# EAGLE schematic ESP32-defkit (EAGLE 9.4.2)
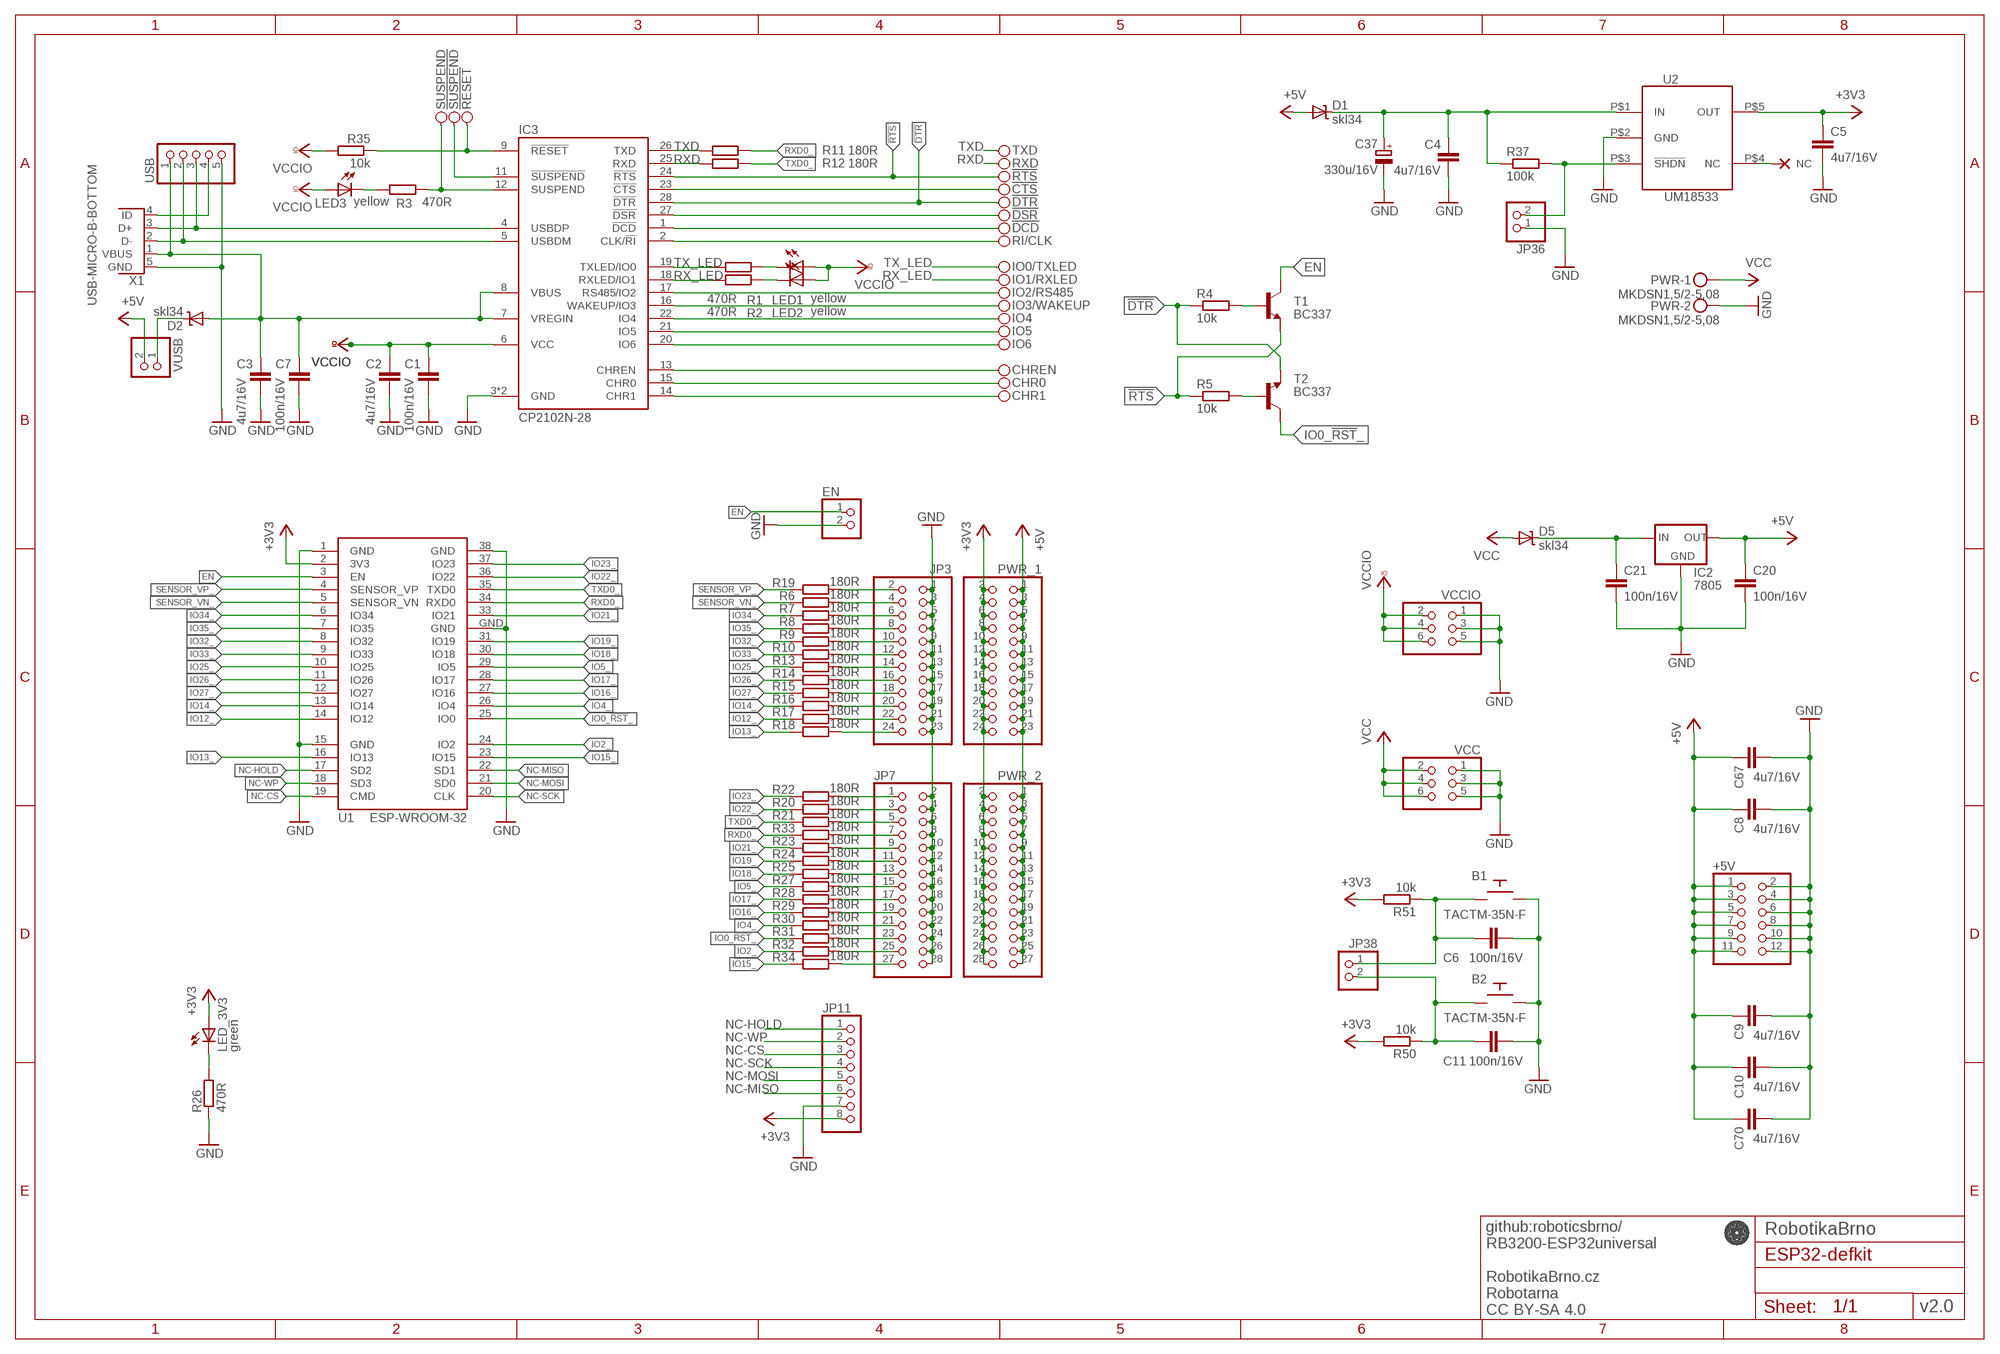
[diagram p0: schematic, sheet 1]

## Parts
!CTS  PINH1X01  [1X01]
!DCD  PINH1X01  [1X01]
!DSR  PINH1X01  [1X01]
!DTR  PINH1X01  [1X01]
!RESET  PINH1X01  [1X01]
!RTS  PINH1X01  [1X01]
!SUSPEND  PINH1X01  [1X01]
+5V  PINHD-2X6  [2X06]
B1  TACTM-35N-F  [TACTM-35N-F]
B2  TACTM-35N-F  [TACTM-35N-F]
C1  100n/16V  C-EUC0402  [C0402]
C2  4u7/16V  C-EUC0603  [C0603]
C3  4u7/16V  C-EUC0603  [C0603]
C4  4u7/16V  C-EUC0603  [C0603]
C5  4u7/16V  C-EUC0603  [C0603]
C6  100n/16V  C-EUC0402  [C0402]
C7  100n/16V  C-EUC0402  [C0402]
C8  4u7/16V  C-EUC0805  [C0805]
C9  4u7/16V  C-EUC0805  [C0805]
C10  4u7/16V  C-EUC0805  [C0805]
C11  100n/16V  C-EUC0402  [C0402]
C20  100n/16V  C-EUC0402  [C0402]
C21  100n/16V  C-EUC0402  [C0402]
C37  330u/16V  CPOL-EUE5-10.5  [E5-10,5]
C67  4u7/16V  C-EUC0805  [C0805]
C70  4u7/16V  C-EUC0805  [C0805]
CHR0  PINH1X01  [1X01]
CHR1  PINH1X01  [1X01]
CHREN  PINH1X01  [1X01]
D1  skl34  SHOTTKY-SOD123  [SOD123]
D2  skl34  SHOTTKY-SOD123  [SOD123]
D5  skl34  SHOTTKY-SOD123  [SOD123]
EN  PINHD-1X2  [1X02]
IC2  7805  78XXS  [78XXS]
IC3  CP2102N-28  [QFN28-PAD]
IO0/TXLED  PINH1X01  [1X01]
IO1/RXLED  PINH1X01  [1X01]
IO2/RS485  PINH1X01  [1X01]
IO3/WAKEUP  PINH1X01  [1X01]
IO4  PINH1X01  [1X01]
IO5  PINH1X01  [1X01]
IO6  PINH1X01  [1X01]
JP3  PINHD-2X12  [2X12]
JP7  PINHD-2X14  [2X14]
JP11  PINHD-1X8  [1X08]
JP36  PINHD-1X2  [1X02]
JP38  PINHD-1X2  [1X02]
LED1  yellow  LEDCHIP-LED0603  [CHIP-LED0603]
LED2  yellow  LEDCHIP-LED0603  [CHIP-LED0603]
LED3  yellow  LEDCHIP-LED0603  [CHIP-LED0603]
LED_3V3  green  LEDCHIPLED_0603  [CHIPLED_0603]
NC3  NC  (no package)
PWR  MKDSN1,5/2-5,08  [MKDSN1,5/2-5,08]
PWR_1  PINHD-2X12  [2X12]
PWR_2  PINHD-2X14  [2X14]
R1  470R  R-EU_R0603  [R0603]
R2  470R  R-EU_R0603  [R0603]
R3  470R  R-EU_R0603  [R0603]
R4  10k  R-EU_R0603  [R0603]
R5  10k  R-EU_R0603  [R0603]
R6  180R  R-EU_R0603  [R0603]
R7  180R  R-EU_R0603  [R0603]
R8  180R  R-EU_R0603  [R0603]
R9  180R  R-EU_R0603  [R0603]
R10  180R  R-EU_R0603  [R0603]
R11  180R  R-EU_R0603  [R0603]
R12  180R  R-EU_R0603  [R0603]
R13  180R  R-EU_R0603  [R0603]
R14  180R  R-EU_R0603  [R0603]
R15  180R  R-EU_R0603  [R0603]
R16  180R  R-EU_R0603  [R0603]
R17  180R  R-EU_R0603  [R0603]
R18  180R  R-EU_R0603  [R0603]
R19  180R  R-EU_R0603  [R0603]
R20  180R  R-EU_R0603  [R0603]
R21  180R  R-EU_R0603  [R0603]
R22  180R  R-EU_R0603  [R0603]
R23  180R  R-EU_R0603  [R0603]
R24  180R  R-EU_R0603  [R0603]
R25  180R  R-EU_R0603  [R0603]
R26  470R  R-EU_R0603  [R0603]
R27  180R  R-EU_R0603  [R0603]
R28  180R  R-EU_R0603  [R0603]
R29  180R  R-EU_R0603  [R0603]
R30  180R  R-EU_R0603  [R0603]
R31  180R  R-EU_R0603  [R0603]
R32  180R  R-EU_R0603  [R0603]
R33  180R  R-EU_R0603  [R0603]
R34  180R  R-EU_R0603  [R0603]
R35  10k  R-EU_R0603  [R0603]
R37  100k  R-EU_R0603  [R0603]
R50  10k  R-EU_R0603  [R0603]
R51  10k  R-EU_R0603  [R0603]
RI/CLK  PINH1X01  [1X01]
RXD  PINH1X01  [1X01]
SUSPEND  PINH1X01  [1X01]
T1  BC337  NPN-SOT23-BEC  [SOT23]
T2  BC337  NPN-SOT23-BEC  [SOT23]
TXD  PINH1X01  [1X01]
U1  ESP-WROOM-32  [ESP-WROOM-32]
U2  UM18533  UM185XX  [SOT23-5]
USB  PINHD-1X5  [1X05]
VCC  PINHD-2X3  [2X03]
VCCIO  PINHD-2X3  [2X03]
VUSB  PINHD-1X2  [1X02]
X1  USB-MICRO-B-BOTTOM  [USB-MICRO-B-BOTTOM-MOLEX]

## Nets
3V3_IN: C4.1 C37.+ D1.C R37.1 U2.P$1(IN)
5V_USB: D2.C VUSB.1
!DTR: !DTR.1 IC3.28(!DTR) R4.1 T2.2(E)
!DTR_B: R4.2 T1.1(B)
!RESET: !RESET.1 IC3.9(!RESET) R35.1
!RTS: !RTS.1 IC3.24(!RTS) R5.1 T1.2(E)
!RTS_B: R5.2 T2.1(B)
!SHDN: JP36.2 R37.2 U2.P$3(!SHDN)
!SUSPEND: !SUSPEND.1 IC3.11(!SUSPEND)
+3V3: C5.1 JP11.8 LED_3V3.A PWR_1.2 PWR_1.4 PWR_1.6 PWR_1.8 PWR_1.10 PWR_1.12 PWR_1.14 PWR_1.16 PWR_1.18 PWR_1.20 PWR_1.22 PWR_1.24 PWR_2.2 PWR_2.4 PWR_2.6 PWR_2.8 PWR_2.10 PWR_2.12 PWR_2.14 PWR_2.16 PWR_2.18 PWR_2.20 PWR_2.22 PWR_2.24 PWR_2.26 PWR_2.28 R50.2 R51.2 U1.2(3V3) U2.P$5(OUT)
+5V: +5V.1 +5V.3 +5V.5 +5V.7 +5V.9 +5V.11 C8.1 C9.1 C10.1 C20.1 C67.1 C70.1 D1.A IC2.OUT PWR_1.1 PWR_1.3 PWR_1.5 PWR_1.7 PWR_1.9 PWR_1.11 PWR_1.13 PWR_1.15 PWR_1.17 PWR_1.19 PWR_1.21 PWR_1.23 PWR_2.1 PWR_2.3 PWR_2.5 PWR_2.7 PWR_2.9 PWR_2.11 PWR_2.13 PWR_2.15 PWR_2.17 PWR_2.19 PWR_2.21 PWR_2.23 PWR_2.25 PWR_2.27 VUSB.2
BTN0: B1.P$4 C6.2 JP38.1 R51.1
BTN1: B2.P$4 C11.2 JP38.2 R50.1
CHR0: CHR0.1 IC3.15(CHR0)
CHR1: CHR1.1 IC3.14(CHR1)
CHREN: CHREN.1 IC3.13(CHREN)
CLK/!RI: IC3.2(CLK/!RI) RI/CLK.1
DCD: !DCD.1 IC3.1(!DCD)
DM: IC3.5(USBDM) USB.2 X1.2(D-)
DP: IC3.4(USBDP) USB.3 X1.3(D+)
DSR: !DSR.1 IC3.27(!DSR)
EN: EN.1 T1.3(C) U1.3(EN)
GND: +5V.2 +5V.4 +5V.6 +5V.8 +5V.10 +5V.12 B1.P$2 B2.P$2 C1.2 C2.2 C3.2 C4.2 C5.2 C6.1 C7.2 C8.2 C9.2 C10.2 C11.1 C20.2 C21.2 C37.- C67.2 C70.2 EN.2 IC2.GND IC3.3(GND) IC3.PAD(GND) JP3.1 JP3.3 JP3.5 JP3.7 JP3.9 JP3.11 JP3.13 JP3.15 JP3.17 JP3.19 JP3.21 JP3.23 JP7.2 JP7.4 JP7.6 JP7.8 JP7.10 JP7.12 JP7.14 JP7.16 JP7.18 JP7.20 JP7.22 JP7.24 JP7.26 JP7.28 JP11.7 JP36.1 PWR.2 R26.1 U1.1(GND) U1.15(GND) U1.38(GND) U1.GND U2.P$2(GND) USB.5 VCC.1 VCC.3 VCC.5 VCCIO.1 VCCIO.3 VCCIO.5 X1.5(GND)
IO0_!RST: JP7.23 R31.1
IO0_!RST!_: R31.2 T2.3(C) U1.25(IO0)
IO2: JP7.25 R32.1
IO2_: R32.2 U1.24(IO2)
IO4: JP7.21 R30.1
IO4_: R30.2 U1.26(IO4)
IO5: JP7.15 R27.1
IO5_: R27.2 U1.29(IO5)
IO12: JP3.22 R17.1
IO12_: R17.2 U1.14(IO12)
IO13: JP3.24 R18.1
IO13_: R18.2 U1.16(IO13)
IO14: JP3.20 R16.1
IO14_: R16.2 U1.13(IO14)
IO15: JP7.27 R34.1
IO15_: R34.2 U1.23(IO15)
IO16: JP7.19 R29.1
IO16_: R29.2 U1.27(IO16)
IO17: JP7.17 R28.1
IO17_: R28.2 U1.28(IO17)
IO18: JP7.13 R25.1
IO18_: R25.2 U1.30(IO18)
IO19: JP7.11 R24.1
IO19_: R24.2 U1.31(IO19)
IO21: JP7.9 R23.1
IO21_: R23.2 U1.33(IO21)
IO22: JP7.3 R20.1
IO22_: R20.2 U1.36(IO22)
IO23: JP7.1 R22.1
IO23_: R22.2 U1.37(IO23)
IO25: JP3.14 R13.1
IO25_: R13.2 U1.10(IO25)
IO26: JP3.16 R14.1
IO26_: R14.2 U1.11(IO26)
IO27: JP3.18 R15.1
IO27_: R15.2 U1.12(IO27)
IO32: JP3.10 R9.1
IO32_: R9.2 U1.8(IO32)
IO33: JP3.12 R10.1
IO33_: R10.2 U1.9(IO33)
IO34: JP3.6 R7.1
IO34_: R7.2 U1.6(IO34)
IO35: JP3.8 R8.1
IO35_: R8.2 U1.7(IO35)
LED_3V3: LED_3V3.C R26.2
N$2: !CTS.1 IC3.23(!CTS)
N$4: LED3.C R3.2
NC-CS: JP11.3 U1.19(CMD)
NC-HOLD: JP11.1 U1.17(SD2)
NC-MISO: JP11.6 U1.22(SD1)
NC-MOSI: JP11.5 U1.21(SD0)
NC-SCK: JP11.4 U1.20(CLK)
NC-WP: JP11.2 U1.18(SD3)
RX-LED: LED2.C R2.1
RX_LED: IC3.18(RXLED/IO1) IO1/RXLED.1 R2.2
RXD: IC3.25(RXD) R12.1 RXD.1
RXD0: JP7.7 R33.1
RXD0_: R11.2 R33.2 U1.34(RXD0)
SENSOR_VN: JP3.4 R6.1
SENSOR_VN_: R6.2 U1.5(SENSOR_VN)
SENSOR_VP: JP3.2 R19.1
SENSOR_VP_: R19.2 U1.4(SENSOR_VP)
SUSPEND: IC3.12(SUSPEND) R3.1 SUSPEND.1
TX-LED: LED1.C R1.1
TX_LED: IC3.19(TXLED/IO0) IO0/TXLED.1 R1.2
TXD: IC3.26(TXD) R11.1 TXD.1
TXD0: JP7.5 R21.1
TXD0_: R12.2 R21.2 U1.35(TXD0)
U2_NC: NC3.NC U2.P$4(NC)
USBID: USB.4 X1.4(ID)
USBIO3_RS485: IC3.17(RS485/IO2) IO2/RS485.1
USBIO3_WAKEUP: IC3.16(WAKEUP/IO3) IO3/WAKEUP.1
USBIO4: IC3.22(IO4) IO4.1
USBIO5: IC3.21(IO5) IO5.1
USBIO6: IC3.20(IO6) IO6.1
VCC: D5.A PWR.1 VCC.2 VCC.4 VCC.6
VCC->5V: C21.1 D5.C IC2.IN
VCCIO: C1.1 C2.1 IC3.6(VCC) LED1.A LED2.A LED3.A R35.2 VCCIO.2 VCCIO.4 VCCIO.6
VUSB: C3.1 C7.1 D2.A IC3.7(VREGIN) IC3.8(VBUS) USB.1 X1.1(VBUS)

## Notes on the sheet
- RobotikaBrno
- v2.0
- github:roboticsbrno/
  RB3200-ESP32universal
  
  RobotikaBrno.cz
  Robotarna
  CC BY-SA 4.0

## Library data of the parts
!CTS !DCD !DSR !DTR !RESET !RTS !SUSPEND CHR0 CHR1 CHREN IO0/TXLED IO1/RXLED IO2/RS485 IO3/WAKEUP IO4-IO6 RI/CLK RXD SUSPEND TXD = pinhead_smd:PINH1X01
+5V = pinhead:PINHD-2X6: PIN HEADER
B1 B2 = TACTM-35N-F:TACTM-35N-F
C1-C11 C20 C21 C67 C70 = rcl_upravena:C-EU: CAPACITOR, European symbol
C37 = rcl_upravena:CPOL-EU: POLARIZED CAPACITOR, European symbol
D1 D2 D5 = diode:SHOTTKY
EN JP36 JP38 VUSB = pinhead:PINHD-1X2: PIN HEADER
IC2 = v-reg:78XXS: VOLTAGE REGULATOR
IC3 = CP2102N:CP2102N-28
JP3 PWR_1 = pinhead:PINHD-2X12: PIN HEADER
JP7 PWR_2 = pinhead:PINHD-2X14: PIN HEADER
JP11 = pinhead:PINHD-1X8: PIN HEADER
LED1-LED3 LED_3V3 = led:LED: LED OSRAM: - CHIPLED LG R971, LG N971, LY N971, LG Q971, LY Q971, LO R971, LY R971 LH N974, LH R974 LS Q976, LO Q976, LY Q976 LO Q996 - Hyper CHIPLED LW Q18S LB Q993, LB Q99A, LB R99A - SideLED LS A670, LO A670, LY A670, LG A670, LP A670 LB A673, LV A673, LT A673, LW A673 LH A674 LY A675 LS A676, LA A676, LO A676, LY A676, LW A676 LS A679, LY A679, LG A679 - Hyper Micro SIDELED® LS Y876, LA Y876, LO Y876, LY Y876 LT Y87S - SmartLED LW L88C, LW L88S LB L89C, LB L89S, LG L890 LS L89K, LO L89K, LY L89K LS L896, LA L896, LO L896, LY L896 - TOPLED LS T670, LO T670, LY T670, LG T670, LP T670 LSG T670, LSP T670, LSY T670, LOP T670, LYG T670 LG T671, LOG T671, LSG T671 LB T673, LV T673, LT T673, LW T673 LH T674 LS T676, LA T676, LO T676, LY T676, LB T676, LH T676, LSB T676, LW T676 LB T67C, LV T67C, LT T67C, LS T67K, LO T67K, LY T67K, LW E67C LS E67B, LA E67B, LO E67B, LY E67B, LB E67C, LV E67C, LT E67C LW T67C LS T679, LY T679, LG T679 LS T770, LO T770, LY T770, LG T770, LP T770 LB T773, LV T773, LT T773, LW T773 LH T774 LS E675, LA E675, LY E675, LS T675 LS T776, LA T776, LO T776, LY T776, LB T776 LHGB T686 LT T68C, LB T68C - Hyper Mini TOPLED® LB M676 - Mini TOPLED Santana® LG M470 LS M47K, LO M47K, LY M47K Source: http://www.osram.convergy.de LUXEON: - LUMILED® LXK2-PW12-R00, LXK2-PW12-S00, LXK2-PW14-U00, LXK2-PW14-V00 LXK2-PM12-R00, LXK2-PM12-S00, LXK2-PM14-U00 LXK2-PE12-Q00, LXK2-PE12-R00, LXK2-PE12-S00, LXK2-PE14-T00, LXK2-PE14-U00 LXK2-PB12-K00, LXK2-PB12-L00, LXK2-PB12-M00, LXK2-PB14-N00, LXK2-PB14-P00, LXK2-PB14-Q00 LXK2-PR12-L00, LXK2-PR12-M00, LXK2-PR14-Q00, LXK2-PR14-R00 LXK2-PD12-Q00, LXK2-PD12-R00, LXK2-PD12-S00 LXK2-PH12-R00, LXK2-PH12-S00 LXK2-PL12-P00, LXK2-PL12-Q00, LXK2-PL12-R00 Source: www.luxeon.com KINGBRIGHT: KA-3528ASYC Source: www.kingbright.com
NC3 = NC:NC: _EXTERNAL_
PWR = con-phoenix-508:MKDSN1,5/2-5,08: MKDSN 1,5/ 2-5,08 Printklemme Nennstrom: 13,5 A Nennspannung: 250 V Rastermaß: 5,08 mm Polzahl: 2 Anschlussart: Schraubanschluss Montage: Löten Anschlussrichtung Leiter/Platine: 0 ° Artikelnummer: 1729128 Source: http://eshop.phoenixcontact.com .. 1729128.pdf
R1-R35 R37 R50 R51 = rcl_upravena:R-EU_: RESISTOR, European symbol
T1 T2 = transistors:NPN
U1 = esp32:ESP-WROOM-32: Espressif Systems ESP-WROOM-32
U2 = um185xx:UM185XX
USB = pinhead:PINHD-1X5: PIN HEADER
VCC VCCIO = pinhead:PINHD-2X3: PIN HEADER
X1 = usb:USB